# EAGLE design 1wire_avr_1te (EAGLE 5.11)
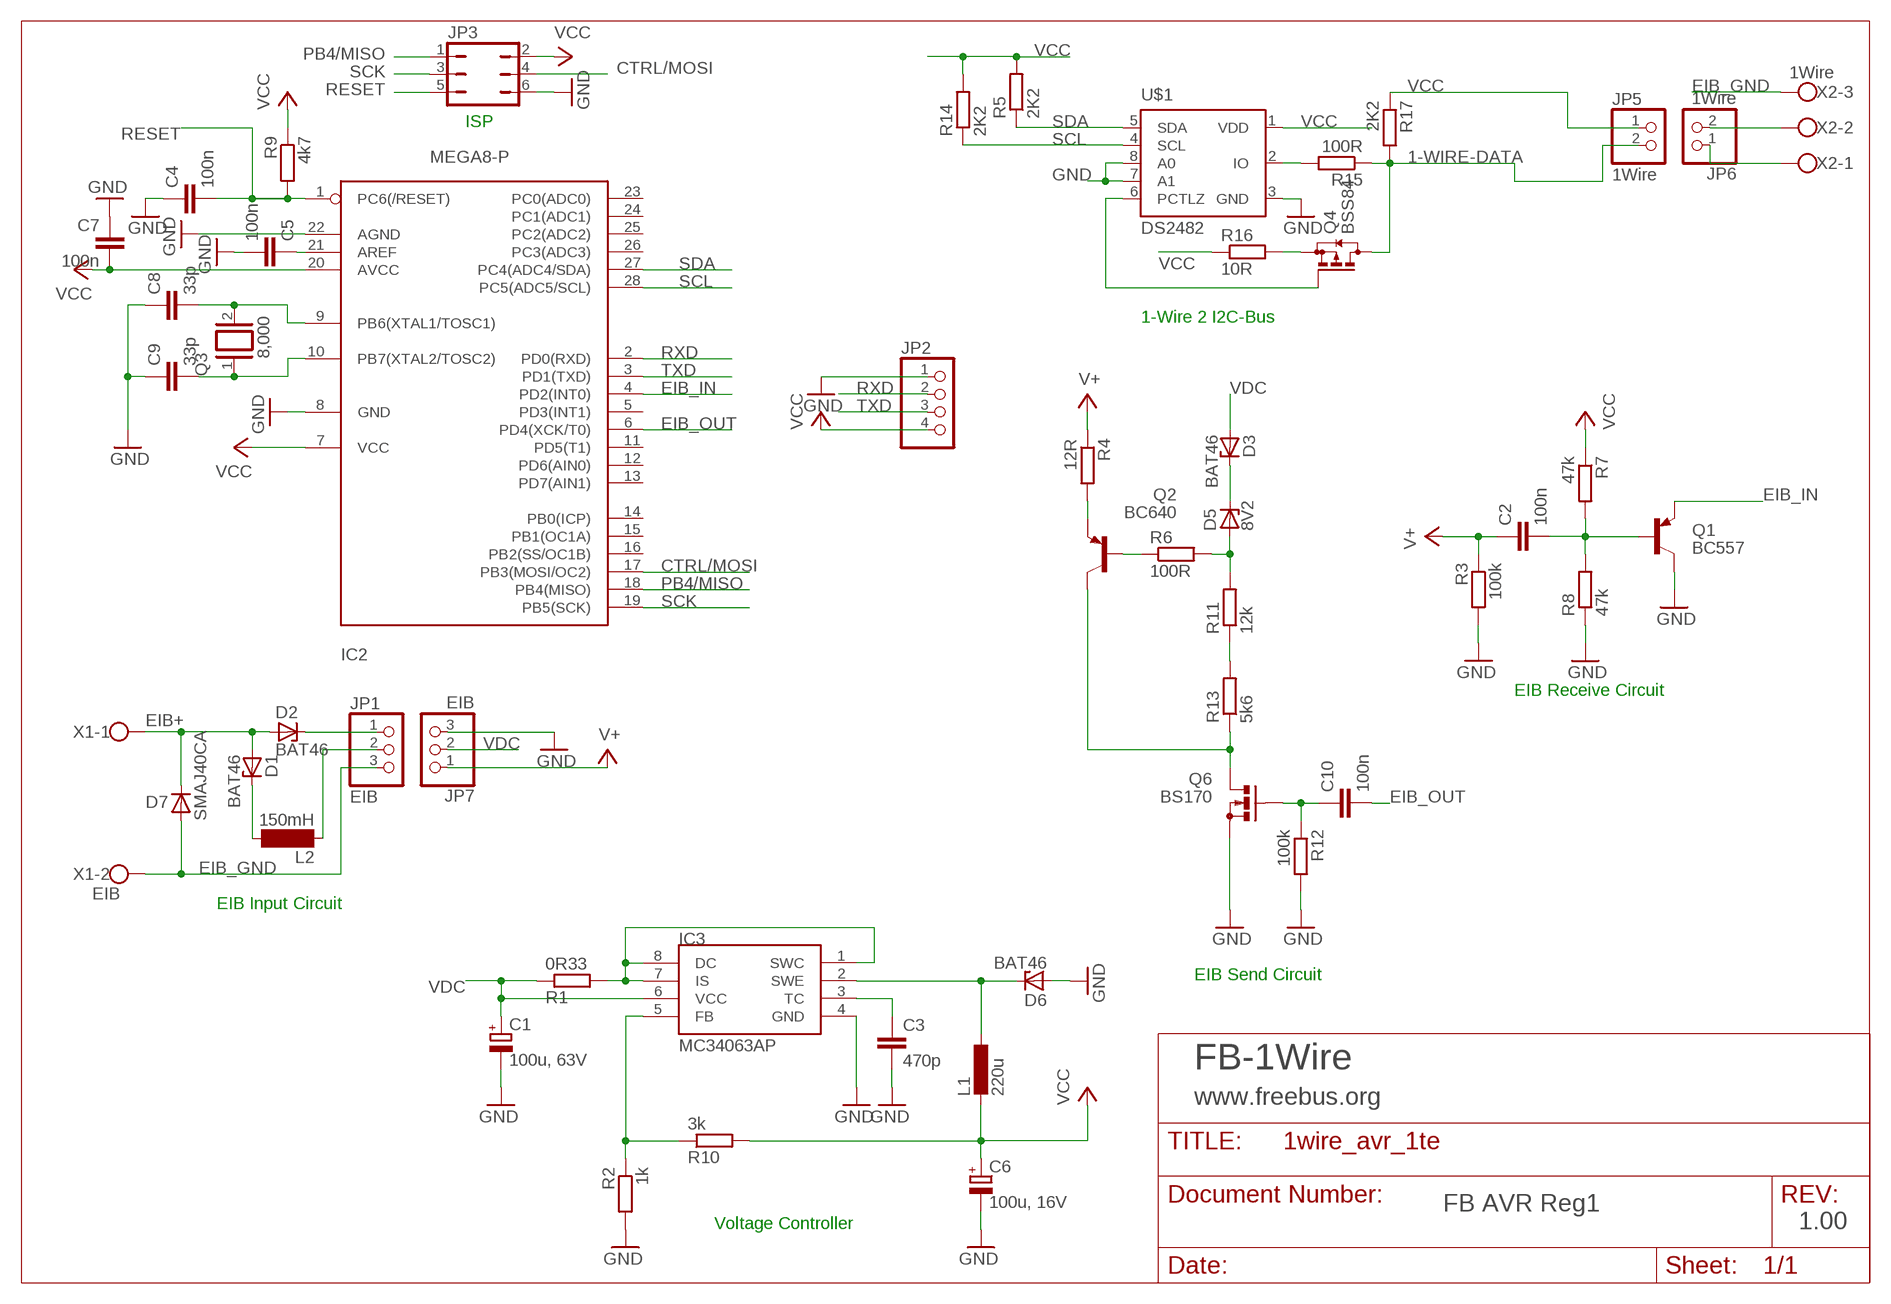
[diagram p0: schematic, sheet 1]

## Parts
C1  100u, 63V  CPOL-EUE5-10.5  [E5-10,5]
C2  100n  C-EU050-025X075  [C050-025X075]
C3  470p  C-EU025-024X044  [C025-024X044]
C4  100n  C-EU050-024X044  [C050-024X044]
C5  100n  C-EU050-025X075  [C050-025X075]
C6  100u, 16V  CPOL-EUE2.5-7  [E2,5-7]
C7  100n  C-EU050-025X075  [C050-025X075]
C8  33p  C-EU025-025X050  [C025-025X050]
C9  33p  C-EU025-025X050  [C025-025X050]
C10  100n  C-EU050-025X075  [C050-025X075]
D1  BAT46  ZENER-DIODEZD-5  [ZDIO-5]
D2  BAT46  ZENER-DIODEZD-5  [ZDIO-5]
D3  BAT46  ZENER-DIODEZD-2.5  [ZDIO-2.5]
D5  8V2  ZENER-DIODEZD-2.5  [ZDIO-2.5]
D6  BAT46  ZENER-DIODEZD-5  [ZDIO-5]
D7  SMAJ40CA  D-SMB  [SMB]
IC2  MEGA8-P  [DIL28-3]
IC3  MC34063AP  [DIL08]
JP1  EIB  PINHD-1X3  [1X03]
JP2  PINHD-1X4  [1X04]
JP3  JP3Q  [JP3Q]
JP5  1Wire  PINHD-1X2  [1X02]
JP6  1Wire  PINHD-1X2  [1X02]
JP7  EIB  PINHD-1X3  [1X03]
L1  220u  L-EU0204/7  [0204/7@1]
L2  150mH  SD12-1000  [SD12_1000]
Q1  BC557  [TO92]
Q2  BC640  [TO92-BCE]
Q3  8,000  XTAL/S  [QS]
Q4  BSS84  [SOT23]
Q6  BS170  [SOT54E]
R1  0R33  R-EU_0204/2V  [0204V]
R2  1k  R-EU_0204/2V  [0204V]
R3  100k  R-EU_0204/2V  [0204V]
R4  12R  R-EU_0204/2V  [0204V]
R5  2K2  R-EU_0204/5  [0204/5]
R6  100R  R-EU_0204/2V  [0204V]
R7  47k  R-EU_0204/2V  [0204V]
R8  47k  R-EU_0204/2V  [0204V]
R9  4k7  R-EU_0204/2V  [0204V]
R10  3k  R-EU_0204/2V  [0204V]
R11  12k  R-EU_0204/2V  [0204V]
R12  100k  R-EU_0204/2V  [0204V]
R13  5k6  R-EU_0204/2V  [0204V]
R14  2K2  R-EU_0204/5  [0204/5]
R15  100R  R-EU_0204/5  [0204/5]
R16  10R  R-EU_0204/5  [0204/5]
R17  2K2  R-EU_0204/2V  [0204V]
U$1  DS2482  [SO08]
X1  EIB  W237-02P  [W237-132]
X2  1Wire  W237-03P  [W237-133]

## Nets
1-WIRE-DATA: JP5.2 Q4.3(D) R15.1 R17.2
CTRL/MOSI: IC2.17(PB3(MOSI/OC2)) JP3.4
EIB+: D1.A D2.A D7.1(C) X1.1
EIB_GND: D7.2(A) JP1.3 X1.2 X2.3
EIB_IN: IC2.4(PD2(INT0)) Q1.1(E)
EIB_OUT: C10.2 IC2.6(PD4(XCK/T0))
GND: C1.- C3.2 C4.1 C5.2 C6.- C7.1 C8.1 C9.1 D6.A IC2.8(GND) IC2.22(AGND) IC3.4(GND) JP2.1 JP3.6 JP7.3 Q1.3(C) Q6.S R2.2 R3.2 R8.1 R12.2 U$1.3(GND) U$1.7(A1) U$1.8(A0)
N$1: Q2.E R4.2
N$2: D3.C D5.C
N$3: C10.1 Q6.G R12.1
N$4: Q2.B R6.1
N$5: Q2.C Q6.D R13.1
N$6: D1.C L2.2
N$7 [supply]: C2.2 Q1.2(B) R7.2 R8.2
N$8: C8.2 IC2.9(PB6(XTAL1/TOSC1)) Q3.2
N$9: C9.2 IC2.10(PB7(XTAL2/TOSC2)) Q3.1
N$10: D5.A R6.2 R11.2
N$11: R15.2 U$1.2(IO)
N$12: IC3.1(SWC) IC3.7(IS) IC3.8(DC) R1.2
N$13: R11.1 R13.2
N$14: D2.C JP1.1
N$15: Q4.1(G) U$1.6(PCTLZ)
N$16: Q4.2(S) R16.2
N$17: JP1.2 L2.1
N$18: JP6.2 X2.2
N$20: D6.C IC3.2(SWE) L1.1
N$21: C3.1 IC3.3(TC)
N$22: IC3.5(FB) R2.1 R10.1
N$24: C5.1 IC2.21(AREF)
N$27: JP6.1 X2.1
PB4/MISO: IC2.18(PB4(MISO)) JP3.1
RESET: C4.2 IC2.1(PC6(/RESET)) JP3.5 R9.2
RXD: IC2.2(PD0(RXD)) JP2.2
SCK: IC2.19(PB5(SCK)) JP3.3
SCL: IC2.28(PC5(ADC5/SCL)) R14.1 U$1.4(SCL)
SDA: IC2.27(PC4(ADC4/SDA)) R5.1 U$1.5(SDA)
TXD: IC2.3(PD1(TXD)) JP2.3
V+: C2.1 JP7.1 R3.1 R4.1
VCC: C6.+ C7.2 IC2.7(VCC) IC2.20(AVCC) JP2.4 JP3.2 JP5.1 L1.2 R5.2 R7.1 R9.1 R10.2 R14.2 R16.1 R17.1 U$1.1(VDD)
VDC [supply]: C1.+ D3.A IC3.6(VCC) JP7.2 R1.1
Unconnected: IC2.5(PD3(INT1)) IC2.11(PD5(T1)) IC2.12(PD6(AIN0)) IC2.13(PD7(AIN1)) IC2.14(PB0(ICP)) IC2.15(PB1(OC1A)) IC2.16(PB2(SS/OC1B)) IC2.23(PC0(ADC0)) IC2.24(PC1(ADC1)) IC2.25(PC2(ADC2)) IC2.26(PC3(ADC3))

## Notes on the sheet
- ISP
- 1-Wire 2 I2C-Bus
- EIB Receive Circuit
- EIB Input Circuit
- EIB Send Circuit
- FB-1Wire
- www.freebus.org
- FB AVR Reg1
- Voltage Controller | 1.00

## Library data of the parts
C1 C6 = rcl:CPOL-EU: POLARIZED CAPACITOR, European symbol
C2-C5 C7-C10 = rcl:C-EU: CAPACITOR, European symbol
D1-D3 D5 D6 = diode:ZENER-DIODE: Z-Diode
D7 = semicon-smd-ipc:D-: DIODE unfilled
IC2 = atmel:MEGA8-P: MICROCONTROLLER 8 Kbytes FLASH, 1 kbytes SRAM, 512 bytes EEPROM, USART, 4-channel 10 bit ADC, 2-channel 8 bit ADC Pin compatible with Atmega48, ATMega88, ATMega168 Source: avr.lbr
IC3 = mc34063:MC34063
JP1 JP7 = pinhead:PINHD-1X3: PIN HEADER
JP2 = pinhead:PINHD-1X4: PIN HEADER
JP3 = jumper:JP3Q: JUMPER
JP5 JP6 = pinhead:PINHD-1X2: PIN HEADER
L1 = rcl:L-EU: INDUCTOR, European symbol
L2 = inductor-neosid:SD12: INDUCTOR nominal inductance
Q1 = transistor-pnp:BC557: PNP Transistor
Q2 = transistor-pnp:BC640*: PNP Transistror
Q3 = special:XTAL/S: CRYSTAL
Q4 = transistor-small-signal:BSS84: P-CHANNEL MOS FET
Q6 = transistor-small-signal:BS170: N-CHANNEL MOS FET
R1-R17 = rcl:R-EU_: RESISTOR, European symbol
U$1 = ge01:DS2482
X1 = con-wago-508:W237-02P: WAGO SREW CLAMP
X2 = con-wago-508:W237-03P: WAGO SREW CLAMP

## Net classes
1 supply: width 0.406 mm

## Board
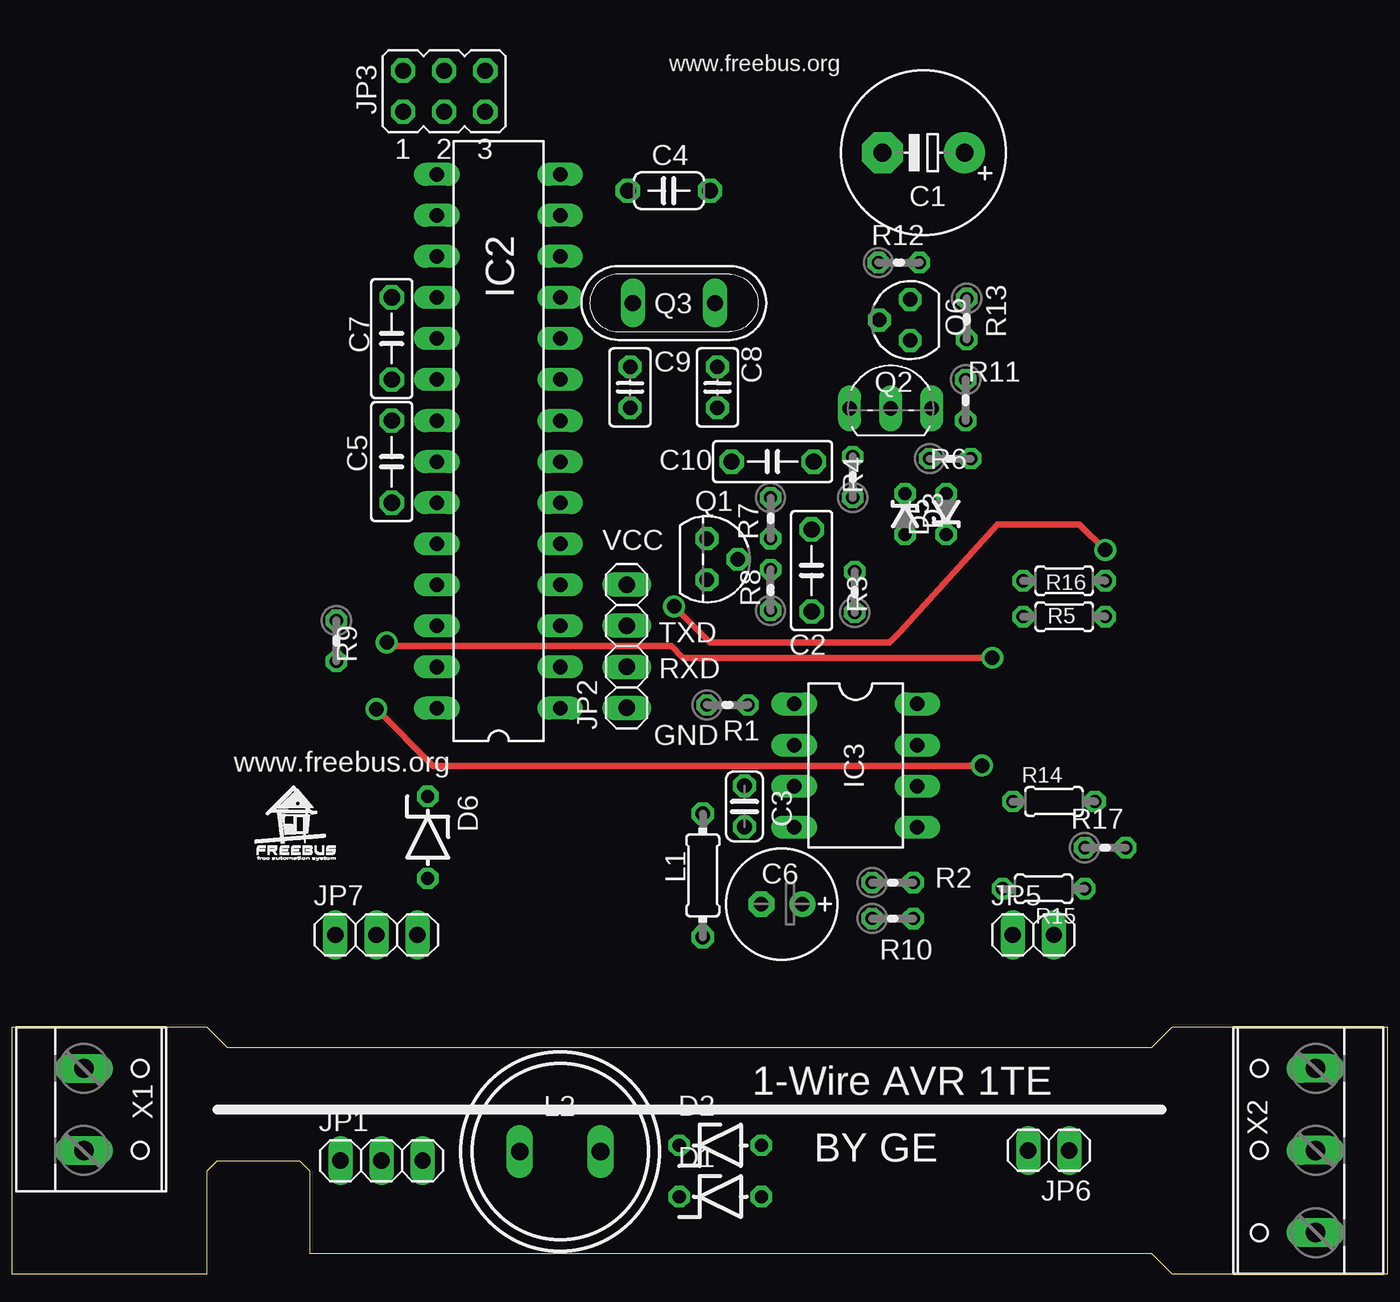
[diagram p1: board, top side]
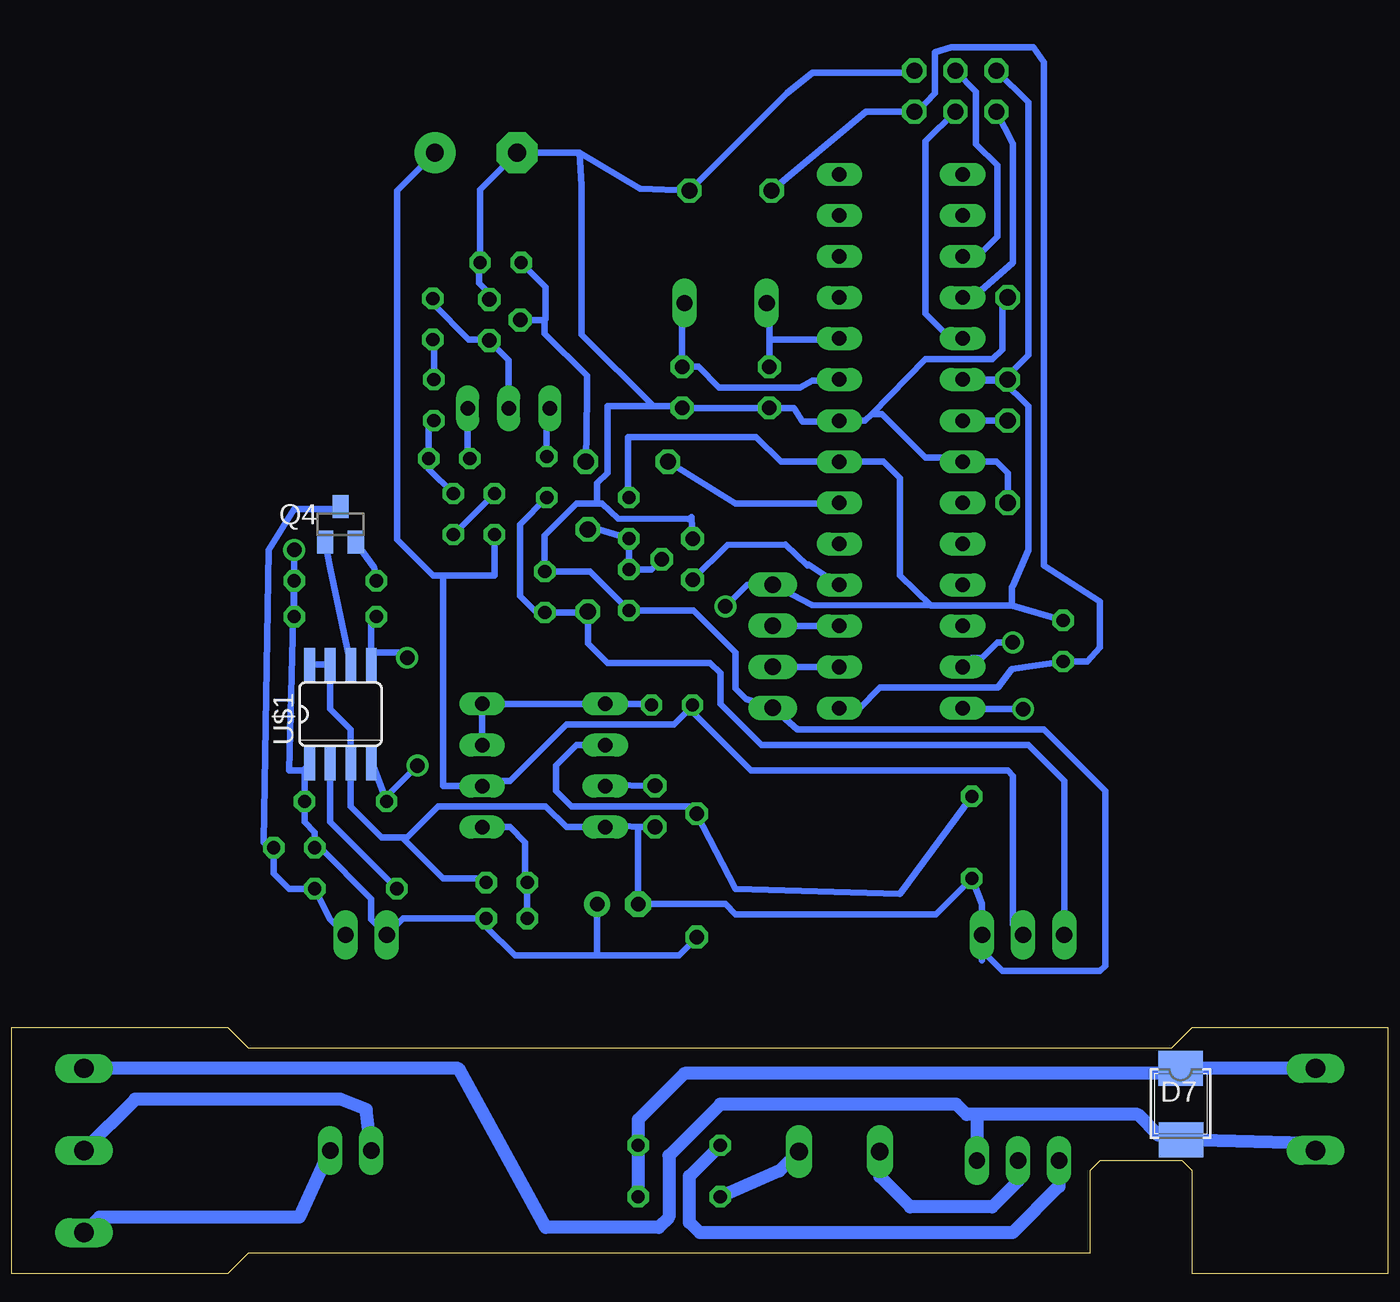
[diagram p2: board, bottom side, seen from below]

No outline drawn. Coordinates in mm, seen from the top.
Copper layers (1*16): Top 0.035mm / dielectric 1.5mm / Bottom 0.035mm
Design rules "0.3mm": minimum track width 10mil, minimum drill 24mil, track to track 0.3mm, track to pad 0.3mm, pad to pad 0.3mm, via to via 0.3mm, smd to smd 0.3mm, copper to edge 0mil, drill to drill 8mil, minimum pad ring 10mil, minimum via ring 8mil, stop-mask expansion 4mil, vias tented up to drill 0mil, thermal gap 10mil
Milling: 16 lines

### Footprints (pad centres in the part's own frame; a part is rotated, then mirrored left to right if it is on the bottom)
E5-10,5 = drill 1.1 pad 2.54 round: + -2.54,0 | drill 1.1 pad 2.54 octagon: - 2.54,0
C050-025X075 = drill 1 octagon: 1 -2.54,0; 2 2.54,0
C025-024X044 = drill 0.9 octagon: 1 -1.27,0; 2 1.27,0
C050-024X044 = drill 1 octagon: 1 -2.54,0; 2 2.54,0
E2,5-7 = drill 0.9 pad 1.6 round: + -1.27,0 | drill 0.9 pad 1.6 octagon: - 1.27,0
C025-025X050 = drill 0.9 octagon: 1 -1.27,0; 2 1.27,0
ZDIO-5 = drill 0.813 octagon: A 2.54,0; C -2.54,0
ZDIO-2.5 = drill 0.813 octagon: A 1.27,0; C -1.27,0
SMB = smd 2.159 x 2.743: 1 -2.311,-0.127; 2 2.108,-0.102
DIL28-3 = drill 0.9 long: 1 -16.51,-3.81; 2 -13.97,-3.81; 3 -11.43,-3.81; 4 -8.89,-3.81; 5 -6.35,-3.81; 6 -3.81,-3.81; 7 -1.27,-3.81; 8 1.27,-3.81; 9 3.81,-3.81; 10 6.35,-3.81; 11 8.89,-3.81; 12 11.43,-3.81; 13 13.97,-3.81; 14 16.51,-3.81; 15 16.51,3.81; 16 13.97,3.81; 17 11.43,3.81; 18 8.89,3.81; 19 6.35,3.81; 20 3.81,3.81; 21 1.27,3.81; 22 -1.27,3.81; 23 -3.81,3.81; 24 -6.35,3.81; 25 -8.89,3.81; 26 -11.43,3.81; 27 -13.97,3.81; 28 -16.51,3.81
DIL08 = drill 0.9 long: 1 -3.81,-3.81; 2 -1.27,-3.81; 3 1.27,-3.81; 4 3.81,-3.81; 5 3.81,3.81; 6 1.27,3.81; 7 -1.27,3.81; 8 -3.81,3.81
1X03 = drill 1.016 long: 1 -2.54,0; 2 0,0; 3 2.54,0
1X04 = drill 1.016 long: 1 -3.81,0; 2 -1.27,0; 3 1.27,0; 4 3.81,0
JP3Q = drill 1 octagon: 1 -2.54,-1.27; 2 -2.54,1.27; 3 0,-1.27; 4 0,1.27; 5 2.54,-1.27; 6 2.54,1.27
1X02 = drill 1.016 long: 1 -1.27,0; 2 1.27,0
0204/7@1 = drill 0.9 octagon: 1 -3.81,0; 2 3.81,0
SD12_1000 = drill 1.1 long: 1 -2.5,0; 2 2.5,0
TO92 = drill 0.9 octagon: 1 1.27,0; 2 0,1.905; 3 -1.27,0
TO92-BCE = drill 0.9 long: B 2.54,0; C 0,0; E -2.54,0
QS = drill 1 long: 1 -2.54,0; 2 2.54,0
SOT23 = smd 1 x 1.4: 1 -0.95,-1.1; 2 0.95,-1.1; 3 0,1.1
SOT54E = drill 0.9 octagon: D -1.27,0; G 0,1.905; S 1.27,0
0204V = drill 0.813 octagon: 1 -1.27,0; 2 1.27,0
0204/5 = drill 0.813 octagon: 1 -2.54,0; 2 2.54,0
SO08 = smd 0.66 x 2.032: 1 -1.905,-3.073; 2 -0.635,-3.073; 3 0.635,-3.073; 4 1.905,-3.073; 5 1.905,3.073; 6 0.635,3.073; 7 -0.635,3.073; 8 -1.905,3.073
W237-132 = drill 1.194 long: 1 -2.54,-0.635; 2 2.54,-0.635
W237-133 = drill 1.194 long: 1 -5.08,-0.635; 2 0,-0.635; 3 5.08,-0.635

### Placement (x,y rotation side)
C1  56.39,69.34 180 top
C2  49.47,43.5 90 top
C3  45.31,28.91 270 top
C4  40.64,66.99 180 top
C5  23.5,50.23 270 top
C6  47.62,22.86 180 top
C7  23.5,57.85 270 top
C8  43.64,54.83 90 top
C9  38.24,54.83 90 top
C10  47.05,50.23 180 top
D1  43.81,4.76 0 top
D2  43.81,7.94 0 top
D3  55.24,46.99 270 top
D5  57.78,46.99 90 top
D6  25.72,26.99 270 top
D7  12.67,10.39 270 bottom
IC2  30.1,51.5 90 top
IC3  52.2,31.43 270 top
JP1  22.86,6.99 0 top
JP2  38.02,38.81 90 top
JP3  26.73,73.15 0 top
JP5  63.18,20.95 0 top
JP6  64.14,7.62 180 top
JP7  22.54,20.95 0 top
L1  42.74,24.64 270 top
L2  33.91,7.56 0 top
Q1  42.99,44.2 270 top
Q2  54.36,53.53 0 top
Q3  40.94,60.05 0 top
Q4  64.77,46.35 0 bottom
Q6  55.56,58.99 90 top
R1  44.26,35.18 0 top
R2  54.48,24.19 0 top
R3  52.13,42.16 90 top
R4  52.01,49.28 90 top
R5  65.09,40.64 0 top
R6  58.04,50.42 0 top
R7  46.93,46.74 270 top
R8  46.93,42.29 90 top
R9  20.07,39.14 270 top
R10  54.48,21.97 0 top
R11  58.99,54.04 270 top
R12  54.86,62.55 0 top
R13  59.05,59.05 270 top
R14  64.45,29.21 0 top
R15  63.82,23.81 180 top
R16  65.09,42.86 180 top
R17  67.63,26.35 0 top
U$1  64.77,34.61 0 bottom
X1  5.08,10.16 270 top
X2  80.01,7.62 90 top

### Tracks (layer width: path | path; a pad name or v marks a point on that pad's centre or on a via)
1-WIRE-DATA
  Bottom 0.406: JP5.2 65.41,21.91 R15.1 67.94,23.81 68.9,24.77 R17.2 69.22,26.35 69.53,26.67 69.22,44.77 67.63,47.31 64.92,47.31 Q4.3
CTRL/MOSI
  Bottom 0.406: JP3.4 25.48,73.11 25.48,69.88 24.13,68.58 24.13,64.14 25.34,62.93 IC2.17
EIB+
  Bottom 0.813: X1.1 D7.1 | D7.1 12.83,12.7 | D7.1 13.12,12.38 43.5,12.38 46.35,9.53 D2.A D1.A
EIB_GND
  Bottom 0.813: X1.2 4.88,8.05 D7.2 14.19,8.57 15.46,9.84 25.4,9.84 | X2.3 57.47,12.7 52.07,2.86 45.09,2.86 44.45,3.49 44.45,7.3 41.27,10.48 26.67,10.48 26.04,9.84 25.4,9.84 | 25.4,9.84 JP1.3
EIB_IN
  Bottom 0.406: Q1.1 40.83,45.09 37.24,45.1 35.88,43.81 35.81,43.88 IC2.4
EIB_OUT
  Bottom 0.406: IC2.6 33.97,47.62 40.32,47.62 C10.2
GND
  Bottom 0.406: C8.1 C9.1 36.73,53.56 36.2,52.7 33.97,52.7 IC2.8 32.32,52.77 31.91,53.18 | JP3.6 29.4,74.3 35.56,74.3 37.15,73.03 C4.1 46.23,67.12 49.97,69.34 | JP7.3 25.08,22.86 D6.A 27.94,22.23 40.32,22.23 40.96,22.86 C6.- 46.35,27.62 45.4,27.62 C3.2 48.32,27.69 IC3.4 50.8,27.62 52.07,28.89 58.74,28.89 60.64,26.99 60.96,26.99 | JP7.3 25.08,19.37 | U$1.8 U$1.7 65.41,34.92 64.14,33.66 U$1.3 64.14,28.89 62.23,26.99 60.96,26.99 | R2.2 56.01,24.45 58.42,24.45 60.96,26.99 | Q6.S 55.56,60.64 56.2,61.28 56.2,62.48 R12.2 56.13,67.06 C1.- 49.97,69.34 | Q1.3 43.05,46.8 43.24,46.67 47.6,46.72 48.58,47.62 48.9,47.62 | 48.9,47.62 50.16,47.62 52.13,45.66 R3.2 49.34,43.43 R8.1 42.93,41.02 40.32,38.42 40.32,36.2 39.69,35.56 JP2.1 36.51,33.66 21.27,33.66 17.46,29.84 17.46,19.05 17.78,18.73 23.81,18.73 25.08,20 JP7.3 | C8.1 43.37,53.29 | 45.4,53.66 43.74,53.66 C8.1 | 45.4,53.66 49.85,58.1 49.85,67.31 49.97,69.34 | C7.1 23.81,60.07 23.81,57.15 24.45,56.57 28.57,56.57 31.91,53.18 | C5.2 23.5,49.53 24.19,50.23 IC2.22 26.54,50.48 28.57,50.48 31.27,53.18 31.91,53.18 | 45.4,53.66 48.26,53.66 48.26,49.53 48.9,48.9 48.9,47.62
N$1
  Bottom 0.406: Q2.E 52.01,53.34 R4.2
N$2
  Bottom 0.406: D5.C D3.C
N$3
  Bottom 0.406: R12.1 52.07,61.02 52.07,59.05 52.13,58.99 | 52.13,58.99 Q6.G | C10.1 49.53,54.29 49.53,55.56 52.13,58.17 52.13,58.99
N$4
  Bottom 0.406: R6.1 56.9,50.55 Q2.B
N$5
  Bottom 0.406: Q2.C 54.36,56.52 Q6.D 55.63,57.78 56.83,57.78 59.05,60.01 R13.1
N$6
  Bottom 0.813: L2.2 37.62,6.35 D1.C
N$7
  Bottom 0.406: C2.2 48.77,46.04 R7.2 R8.2 45.53,43.56 Q1.2
N$8
  Bottom 0.406: IC2.9 33.97,55.24 35.56,55.24 36.36,54.83 41.35,54.81 42.63,56.1 C8.2 43.64,59.89 Q3.2
N$9
  Bottom 0.406: Q3.1 38.24,59.88 38.24,57.78 | 38.24,57.78 C9.2 | IC2.10 33.97,57.78 38.24,57.78
N$10
  Bottom 0.406: R11.2 59.31,52.45 R6.2 59.31,49.78 D5.A
N$11
  Bottom 0.406: U$1.2 65.41,27.94 R15.2
N$12
  Bottom 0.406: R1.2 45.59,35.24 IC3.1 IC3.8 IC3.7
N$13
  Bottom 0.406: R13.2 58.99,57.72 R11.1
N$14
  Bottom 0.813: D2.C 43.18,6.03 43.18,3.17 42.55,2.54 23.18,2.54 20.32,5.4 JP1.1
N$15
  Bottom 0.406: Q4.1 65.41,43.66 U$1.6
N$16
  Bottom 0.406: R16.2 62.7,43.67 Q4.2
N$17
  Bottom 0.813: JP1.2 22.86,5.71 24.45,4.13 29.53,4.13 31.41,6.01 L2.1
N$18
  Bottom 0.813: X2.2 77.47,10.79 64.77,10.79 63.18,10.16 JP6.2
N$20
  Bottom 0.406: D6.C 30.16,23.5 40.32,23.81 L1.1 43.18,28.89 50.48,28.89 51.44,29.84 51.44,31.43 50.16,32.7 IC3.2
N$21
  Bottom 0.406: IC3.3 48.32,30.23 C3.1
N$22
  Bottom 0.406: R10.1 R2.1 53.34,24.32 53.34,26.67 54.29,27.62 IC3.5
N$24
  Bottom 0.406: C5.1 IC2.21
N$27
  Bottom 0.813: X2.1 79.69,3.49 67.31,3.49 JP6.1
PB4/MISO
  Bottom 0.406: JP3.1 23.18,69.91 23.18,62.55 25.65,60.39 IC2.18
RESET
  Bottom 0.406: C4.2 32.26,71.88 JP3.5 29.08,71.88 27.99,73.03 27.99,75.56 26.99,75.88 21.91,75.88 21.27,74.93 21.27,43.81 17.78,41.59 17.78,38.73 18.58,37.87 R9.2 23.24,37.4 24.11,36.25 31.41,36.25 32.7,34.92 33.85,34.92 IC2.1
RXD
  Bottom 0.406: JP2.2 37.85,37.53 IC2.2
SCK
  Bottom 0.406: JP3.3 28.57,70.04 28.57,59.37 27.05,57.85 IC2.19
SCL  (via drill 0.9)
  Top 0.406: v22.54,34.92 26.05,31.42 59.23,31.42 59.24,31.43 v60.01,31.43
  Bottom 0.406: U$1.4 62.76,31.43 R14.1 61.91,29.53 v60.01,31.43 | IC2.28 26.23,34.92 v22.54,34.92
SDA  (via drill 0.9)
  Top 0.406: v23.18,39.05 23.42,38.81 40.79,38.81 41.5,38.1 v60.64,38.1
  Bottom 0.406: R5.1 62.87,40.32 62.87,38.42 | 62.87,38.42 U$1.5 | IC2.27 25.72,38.1 25.08,38.1 24.13,39.05 v23.18,39.05 | v60.64,38.1 60.96,38.42 62.87,38.42
TXD
  Bottom 0.406: JP2.3 37.85,40.07 IC2.3
V+
  Bottom 0.406: R4.1 53.66,46.35 53.66,41.91 52.64,40.89 R3.1 49.53,40.89 C2.1 49.47,38.99 48.26,37.78 41.91,37.78 41.27,37.15 41.27,35.24 38.73,32.7 22.23,32.7 20,30.48 JP7.1
VCC  (via drill 0.9)
  Top 0.406: v67.63,44.77 66.04,46.35 60.96,46.35 54.93,39.69 54.29,39.05 43.18,39.05 v40.96,41.27
  Bottom 0.406: 28.26,41.33 30.16,43.18 30.16,49.21 31.18,50.23 IC2.7 37.53,50.23 39.05,51.75 46.99,51.75 46.99,48.07 R7.1 | U$1.1 66.99,31.22 66.99,31.11 | 48.9,19.68 C6.+ | 48.9,19.68 53.98,19.68 55.75,21.46 R10.2 60.9,21.97 JP5.1 62.87,21.91 62.87,23.18 66.04,26.35 R17.1 66.36,27.3 66.99,27.94 R14.2 66.99,31.11 | L1.2 42.86,20.7 42.86,20.64 43.81,19.68 48.9,19.68 | JP3.2 22.23,72.45 22.23,56.83 23.5,55.56 C7.2 IC2.20 26.23,55.24 23.81,55.24 22.23,53.66 22.23,44.77 23.18,42.55 23.24,42.48 23.24,41.33 | 28.26,41.33 35.6,41.35 JP2.4 39.64,42.6 v40.96,41.27 | 66.99,31.11 67.94,31.11 R16.1 R5.2 v67.63,44.77 | R9.1 23.24,41.33 | 23.24,41.33 28.26,41.33
VDC
  Bottom 0.406: C1.+ 61.28,66.99 61.28,45.4 59.05,43.18 58.42,43.18 | 58.42,43.18 55.24,43.18 D3.A | 58.42,43.18 58.42,30.16 IC3.6 55.69,30.48 54.29,30.48 50.8,33.97 44.13,33.97 42.99,35.12 R1.1 42.99,34.73 39.37,31.11 23.5,31.11 23.18,30.8 23.18,21.59 JP7.2

### Text on the board
tNames: www.freebus.org | VCC | TXD | RXD | GND | www.freebus.org | 1-Wire AVR 1TE | BY GE